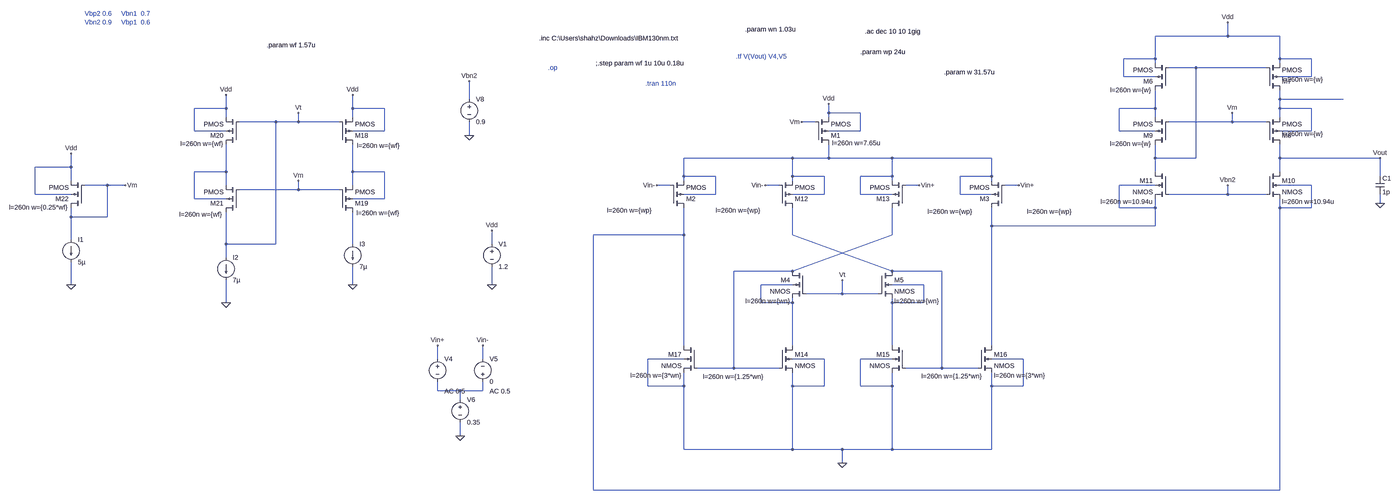
[diagram p0: schematic Recyclic_Folded_Cascode_Schm.asc, whole sheet]
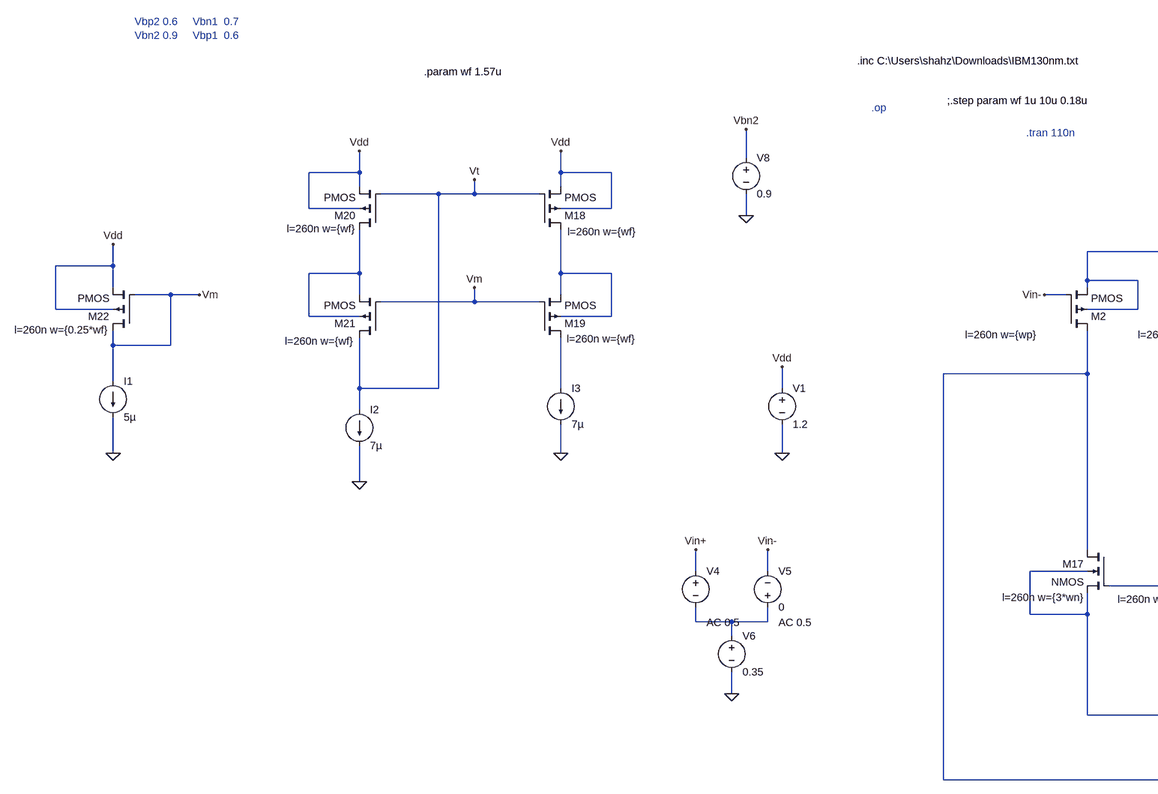
[diagram p1: schematic Recyclic_Folded_Cascode_Schm.asc, part, row 1 of 1, column 1 of 2]
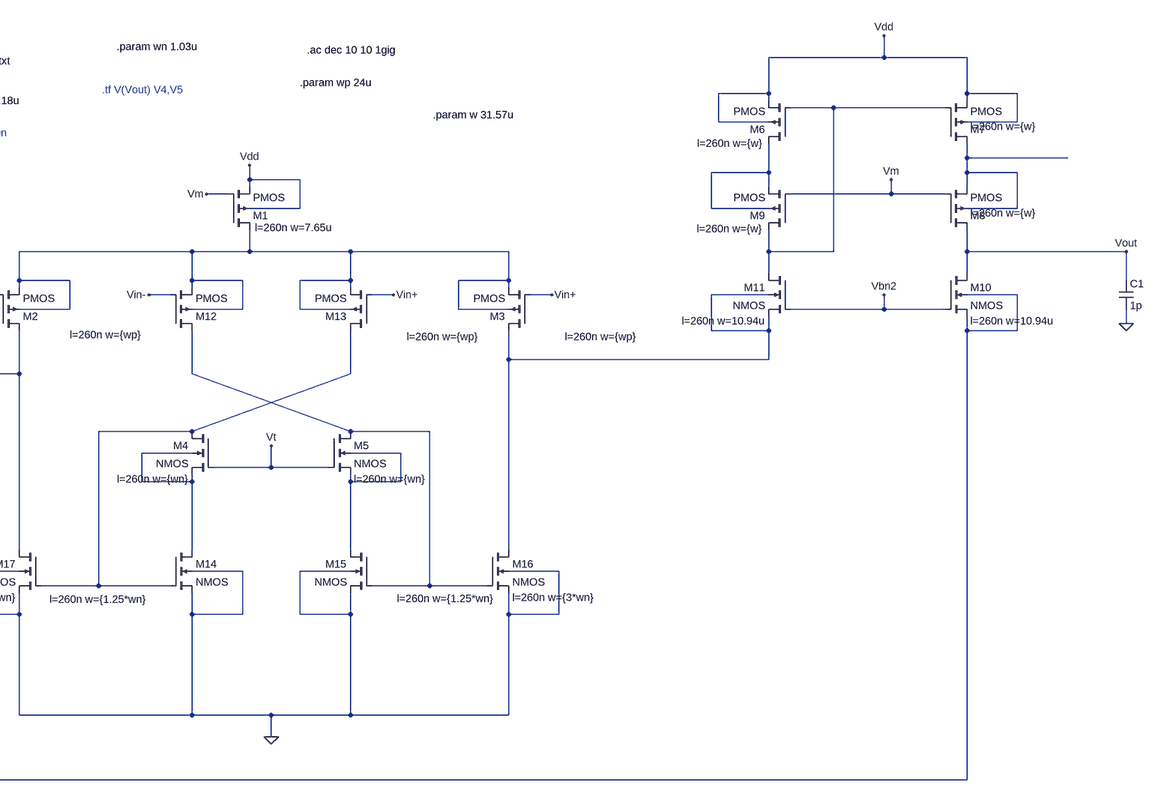
[diagram p2: schematic Recyclic_Folded_Cascode_Schm.asc, part, row 1 of 1, column 2 of 2]
Recyclic_Folded_Cascode_Schm.asc, the LTspice schematic file:
Version 4
SHEET 1 3360 2056
WIRE 1728 192 1728 144
WIRE 1728 192 1472 192
WIRE 1984 192 1728 192
WIRE 1472 272 1472 192
WIRE 1472 272 1360 272
WIRE 1984 272 1984 192
WIRE 2096 272 1984 272
WIRE 1472 288 1472 272
WIRE 1984 288 1984 272
WIRE 1616 304 1520 304
WIRE 1936 304 1616 304
WIRE 1360 336 1360 272
WIRE 1472 336 1360 336
WIRE 2096 336 2096 272
WIRE 2096 336 1984 336
WIRE -1312 416 -1312 352
WIRE 1984 416 1984 384
WIRE 2208 416 1984 416
WIRE -2192 448 -2192 400
WIRE -2192 448 -2304 448
WIRE -1744 448 -1744 400
WIRE -1632 448 -1744 448
WIRE 1472 448 1472 384
WIRE 1472 448 1344 448
WIRE 1984 448 1984 416
WIRE 2096 448 1984 448
WIRE 64 464 64 432
WIRE 176 464 64 464
WIRE -2192 480 -2192 448
WIRE -1744 480 -1744 448
WIRE 64 480 64 464
WIRE 1472 480 1472 448
WIRE 1984 480 1984 448
WIRE -2016 496 -2144 496
WIRE -1936 496 -1936 464
WIRE -1936 496 -2016 496
WIRE -1792 496 -1936 496
WIRE 16 496 -32 496
WIRE 1744 496 1744 464
WIRE 1744 496 1520 496
WIRE 1936 496 1744 496
WIRE -2304 528 -2304 448
WIRE -2192 528 -2304 528
WIRE -1632 528 -1632 448
WIRE -1632 528 -1744 528
WIRE 176 528 176 464
WIRE 176 528 64 528
WIRE 1344 528 1344 448
WIRE 1472 528 1344 528
WIRE 2096 528 2096 448
WIRE 2096 528 1984 528
WIRE -1312 544 -1312 496
WIRE -64 624 -448 624
WIRE 64 624 64 576
WIRE 64 624 -64 624
WIRE 288 624 64 624
WIRE 640 624 288 624
WIRE 1472 624 1472 576
WIRE 1616 624 1616 304
WIRE 1616 624 1472 624
WIRE 1984 624 1984 576
WIRE 2400 624 1984 624
WIRE -2768 656 -2768 608
WIRE -2768 656 -2896 656
WIRE -2192 672 -2192 576
WIRE -2192 672 -2304 672
WIRE -1744 672 -1744 576
WIRE -1632 672 -1744 672
WIRE 1472 672 1472 624
WIRE 1984 672 1984 624
WIRE -448 688 -448 624
WIRE -336 688 -448 688
WIRE -64 688 -64 624
WIRE 48 688 -64 688
WIRE 288 688 288 624
WIRE 288 688 176 688
WIRE 640 688 640 624
WIRE 640 688 528 688
WIRE 2400 688 2400 624
WIRE -2768 704 -2768 656
WIRE -448 704 -448 688
WIRE -64 704 -64 688
WIRE 288 704 288 688
WIRE 640 704 640 688
WIRE -2640 720 -2720 720
WIRE -2576 720 -2640 720
WIRE -2192 720 -2192 672
WIRE -1744 720 -1744 672
WIRE -496 720 -544 720
WIRE -112 720 -160 720
WIRE 384 720 336 720
WIRE 736 720 688 720
WIRE 1472 720 1344 720
WIRE 2096 720 1984 720
WIRE -1936 736 -1936 704
WIRE -1936 736 -2144 736
WIRE -1792 736 -1936 736
WIRE -2896 752 -2896 656
WIRE -2768 752 -2896 752
WIRE -336 752 -336 688
WIRE -336 752 -448 752
WIRE 48 752 48 688
WIRE 48 752 -64 752
WIRE 176 752 176 688
WIRE 288 752 176 752
WIRE 528 752 528 688
WIRE 640 752 528 752
WIRE 1728 752 1728 720
WIRE 1728 752 1520 752
WIRE 1936 752 1728 752
WIRE -2304 768 -2304 672
WIRE -2192 768 -2304 768
WIRE -1632 768 -1632 672
WIRE -1632 768 -1744 768
WIRE 2400 784 2400 752
WIRE 1344 800 1344 720
WIRE 1472 800 1472 768
WIRE 1472 800 1344 800
WIRE 1984 800 1984 768
WIRE 2096 800 2096 720
WIRE 2096 800 1984 800
WIRE -2768 832 -2768 800
WIRE -2640 832 -2640 720
WIRE -2640 832 -2768 832
WIRE 640 864 640 800
WIRE 1472 864 1472 800
WIRE 1472 864 640 864
WIRE -448 896 -448 800
WIRE -448 896 -768 896
WIRE -64 896 -64 800
WIRE 288 896 288 800
WIRE -2768 912 -2768 832
WIRE -2192 928 -2192 816
WIRE -2016 928 -2016 496
WIRE -2016 928 -2192 928
WIRE -1744 928 -1744 816
WIRE -1232 928 -1232 880
WIRE -2192 976 -2192 928
WIRE -64 1024 288 896
WIRE -64 1024 -272 1024
WIRE 288 1024 -64 896
WIRE 464 1024 288 1024
WIRE -2768 1072 -2768 992
WIRE -1744 1072 -1744 1008
WIRE -1232 1072 -1232 1008
WIRE -64 1072 -176 1072
WIRE 400 1072 288 1072
WIRE 112 1104 112 1056
WIRE 112 1104 -16 1104
WIRE 240 1104 112 1104
WIRE -2192 1136 -2192 1056
WIRE -176 1136 -176 1072
WIRE -64 1136 -64 1120
WIRE -64 1136 -176 1136
WIRE 288 1136 288 1120
WIRE 400 1136 400 1072
WIRE 400 1136 288 1136
WIRE -448 1312 -448 896
WIRE -64 1312 -64 1136
WIRE 288 1312 288 1136
WIRE 640 1312 640 864
WIRE -1424 1360 -1424 1312
WIRE -1264 1360 -1264 1312
WIRE -448 1360 -576 1360
WIRE 48 1360 -64 1360
WIRE 288 1360 176 1360
WIRE 752 1360 640 1360
WIRE -272 1392 -272 1024
WIRE -272 1392 -400 1392
WIRE -112 1392 -272 1392
WIRE 464 1392 464 1024
WIRE 464 1392 336 1392
WIRE 592 1392 464 1392
WIRE -576 1456 -576 1360
WIRE -448 1456 -448 1408
WIRE -448 1456 -576 1456
WIRE -64 1456 -64 1408
WIRE 48 1456 48 1360
WIRE 48 1456 -64 1456
WIRE 176 1456 176 1360
WIRE 288 1456 288 1408
WIRE 288 1456 176 1456
WIRE 640 1456 640 1408
WIRE 752 1456 752 1360
WIRE 752 1456 640 1456
WIRE -1424 1472 -1424 1440
WIRE -1344 1472 -1424 1472
WIRE -1264 1472 -1264 1440
WIRE -1264 1472 -1344 1472
WIRE -1344 1504 -1344 1472
WIRE -1344 1632 -1344 1584
WIRE -448 1680 -448 1456
WIRE -64 1680 -64 1456
WIRE -64 1680 -448 1680
WIRE 112 1680 -64 1680
WIRE 288 1680 288 1456
WIRE 288 1680 112 1680
WIRE 640 1680 640 1456
WIRE 640 1680 288 1680
WIRE 112 1728 112 1680
WIRE -768 1824 -768 896
WIRE 1984 1824 1984 800
WIRE 1984 1824 -768 1824
FLAG 64 432 Vdd
FLAG 736 720 Vin+
FLAG -1232 1072 0
FLAG -1232 880 Vdd
FLAG -1344 1632 0
FLAG -1424 1312 Vin+
FLAG -1264 1312 Vin-
FLAG 1728 144 Vdd
FLAG 1728 720 Vbn2
FLAG -1312 544 0
FLAG -1312 352 Vbn2
FLAG 2400 784 0
FLAG 2400 624 Vout
FLAG 384 720 Vin+
FLAG 112 1728 0
FLAG -544 720 Vin-
FLAG -160 720 Vin-
FLAG -2768 1072 0
FLAG -2768 608 Vdd
FLAG -2576 720 Vm
FLAG -2192 400 Vdd
FLAG -1744 400 Vdd
FLAG -2192 1136 0
FLAG -1936 704 Vm
FLAG -1936 464 Vt
FLAG -1744 1072 0
FLAG 1744 464 Vm
FLAG -32 496 Vm
FLAG 112 1056 Vt
DATAFLAG 672 864 ""
DATAFLAG 144 624 ""
DATAFLAG 2176 624 ""
DATAFLAG 2192 416 ""
DATAFLAG -64 880 ""
SYMBOL pmos4 16 576 M180
WINDOW 123 60 5 Left 2
SYMATTR Value2 l=260n w=7.65u
SYMATTR InstName M1
SYMBOL pmos4 -496 800 M180
WINDOW 123 -224 -9 Left 2
SYMATTR Value2 l=260n w={wp}
SYMATTR InstName M2
SYMBOL pmos4 688 800 R180
WINDOW 123 -236 -13 Left 2
SYMATTR Value2 l=260n w={wp}
SYMATTR InstName M3
SYMBOL nmos4 -16 1024 M0
WINDOW 123 56 106 Left 2
SYMATTR Value2 l=260n w={wn}
SYMATTR InstName M4
SYMBOL nmos4 240 1024 R0
WINDOW 123 56 106 Left 2
SYMATTR Value2 l=260n w={wn}
SYMATTR InstName M5
SYMBOL voltage -1232 912 R0
WINDOW 123 0 0 Left 0
WINDOW 39 0 0 Left 0
SYMATTR InstName V1
SYMATTR Value 1.2
SYMBOL voltage -1424 1344 R0
WINDOW 123 24 130 Left 2
WINDOW 39 0 0 Left 0
WINDOW 3 24 50 Left 2
SYMATTR Value2 AC 0.5
SYMATTR Value ""
SYMATTR InstName V4
SYMBOL voltage -1264 1456 M180
WINDOW 0 24 96 Left 2
WINDOW 3 24 16 Left 2
WINDOW 123 24 -18 Left 2
WINDOW 39 0 0 Left 0
SYMATTR InstName V5
SYMATTR Value 0
SYMATTR Value2 AC 0.5
SYMBOL voltage -1344 1488 R0
WINDOW 123 0 0 Left 0
WINDOW 39 0 0 Left 0
SYMATTR InstName V6
SYMATTR Value 0.35
SYMBOL pmos4 1520 384 R180
WINDOW 123 62 1 Left 2
SYMATTR Value2 l=260n w={w}
SYMATTR InstName M6
SYMBOL pmos4 1936 384 M180
WINDOW 123 56 38 Left 2
SYMATTR Value2 l=260n w={w}
SYMATTR InstName M7
SYMBOL pmos4 1936 576 M180
WINDOW 123 56 38 Left 2
SYMATTR Value2 l=260n w={w}
SYMATTR InstName M8
SYMBOL pmos4 1520 576 R180
WINDOW 123 63 3 Left 2
SYMATTR Value2 l=260n w={w}
SYMATTR InstName M9
SYMBOL nmos4 1936 672 R0
WINDOW 123 56 106 Left 2
SYMATTR Value2 l=260n w=10.94u
SYMATTR InstName M10
SYMBOL nmos4 1520 672 M0
WINDOW 123 56 106 Left 2
SYMATTR Value2 l=260n w=10.94u
SYMATTR InstName M11
SYMBOL voltage -1312 400 R0
WINDOW 123 0 0 Left 0
WINDOW 39 0 0 Left 0
SYMATTR InstName V8
SYMATTR Value 0.9
SYMBOL cap 2384 688 R0
SYMATTR InstName C1
SYMATTR Value 1p
SYMBOL pmos4 -112 800 M180
WINDOW 123 -224 -9 Left 2
SYMATTR Value2 l=260n w={wp}
SYMATTR InstName M12
SYMBOL pmos4 336 800 R180
WINDOW 123 -236 -13 Left 2
SYMATTR Value2 l=260n w={wp}
SYMATTR InstName M13
SYMBOL nmos4 -400 1312 M0
WINDOW 123 56 106 Left 2
SYMATTR Value2 l=260n w={3*wn}
SYMATTR InstName M17
SYMBOL nmos4 -112 1312 R0
WINDOW 123 -269 110 Left 2
SYMATTR Value2 l=260n w={1.25*wn}
SYMATTR InstName M14
SYMBOL nmos4 336 1312 M0
WINDOW 123 -271 109 Left 2
SYMATTR Value2 l=260n w={1.25*wn}
SYMATTR InstName M15
SYMBOL nmos4 592 1312 R0
WINDOW 123 56 106 Left 2
SYMATTR Value2 l=260n w={3*wn}
SYMATTR InstName M16
SYMBOL pmos4 -1792 576 M180
WINDOW 123 63 -4 Left 2
SYMATTR Value2 l=260n w={wf}
SYMATTR InstName M18
SYMBOL pmos4 -1792 816 M180
WINDOW 123 61 -2 Left 2
SYMATTR Value2 l=260n w={wf}
SYMATTR InstName M19
SYMBOL pmos4 -2144 576 R180
WINDOW 123 57 3 Left 2
SYMATTR Value2 l=260n w={wf}
SYMATTR InstName M20
SYMBOL pmos4 -2144 816 R180
WINDOW 123 61 -7 Left 2
SYMATTR Value2 l=260n w={wf}
SYMATTR InstName M21
SYMBOL pmos4 -2720 800 R180
WINDOW 123 59 2 Left 2
SYMATTR Value2 l=260n w={0.25*wf}
SYMATTR InstName M22
SYMBOL current -2768 912 R0
WINDOW 123 0 0 Left 0
WINDOW 39 0 0 Left 0
SYMATTR InstName I1
SYMATTR Value 5µ
SYMBOL current -2192 976 R0
WINDOW 123 0 0 Left 0
WINDOW 39 0 0 Left 0
SYMATTR InstName I2
SYMATTR Value 7µ
SYMBOL current -1744 928 R0
WINDOW 123 0 0 Left 0
WINDOW 39 0 0 Left 0
SYMATTR InstName I3
SYMATTR Value 7µ
TEXT -960 200 Left 2 !.inc C:\\Users\\shahz\\Downloads\\IBM130nm.txt
TEXT 176 248 Left 2 !.param wp 24u
TEXT -232 168 Left 2 !.param wn 1.03u
TEXT -760 288 Left 2 !;.step param wf 1u 10u 0.18u
TEXT -928 304 Left 2 ;.op
TEXT 192 176 Left 2 !.ac dec 10 10 1gig
TEXT -264 264 Left 2 ;.tf V(Vout) V4,V5
TEXT 472 320 Left 2 !.param w 31.57u
TEXT -584 360 Left 2 ;.tran 110n
TEXT -2048 224 Left 2 !.param wf 1.57u
TEXT -2720 112 Left 2 ;Vbp2 0.6     Vbn1  0.7\nVbn2 0.9     Vbp1  0.6

The netlist it stands for:
* Recyclic_Folded_Cascode_Schm.asc
M1 N004 Vm Vdd Vdd PMOS l=260n w=7.65u
M2 N008 Vin- N004 N004 PMOS l=260n w={wp}
M3 N007 Vin+ N004 N004 PMOS l=260n w={wp}
M4 N010 Vt N012 N012 NMOS l=260n w={wn}
M5 N009 Vt N013 N013 NMOS l=260n w={wn}
V1 Vdd 0 1.2
V4 Vin+ N014 AC 0.5
V5 N014 Vin- 0 AC 0.5
V6 N014 0 0.35
M6 N003 N001 Vdd Vdd PMOS l=260n w={w}
M7 N002 N001 Vdd Vdd PMOS l=260n w={w}
M8 Vout Vm N002 N002 PMOS l=260n w={w}
M9 N001 Vm N003 N003 PMOS l=260n w={w}
M10 Vout Vbn2 N008 N008 NMOS l=260n w=10.94u
M11 N001 Vbn2 N007 N007 NMOS l=260n w=10.94u
V8 Vbn2 0 0.9
C1 Vout 0 1p
M12 N009 Vin- N004 N004 PMOS l=260n w={wp}
M13 N010 Vin+ N004 N004 PMOS l=260n w={wp}
M17 N008 N010 0 0 NMOS l=260n w={3*wn}
M14 N012 N010 0 0 NMOS l=260n w={1.25*wn}
M15 N013 N009 0 0 NMOS l=260n w={1.25*wn}
M16 N007 N009 0 0 NMOS l=260n w={3*wn}
M18 N006 Vt Vdd Vdd PMOS l=260n w={wf}
M19 N011 Vm N006 N006 PMOS l=260n w={wf}
M20 N005 Vt Vdd Vdd PMOS l=260n w={wf}
M21 Vt Vm N005 N005 PMOS l=260n w={wf}
M22 Vm Vm Vdd Vdd PMOS l=260n w={0.25*wf}
I1 Vm 0 5µ
I2 Vt 0 7µ
I3 N011 0 7µ
.model NMOS NMOS
.model PMOS PMOS
.lib standard.mos
.inc C:\Users\shahz\Downloads\IBM130nm.txt
.param wp 24u
.param wn 1.03u
;.step param wf 1u 10u 0.18u
* .op
.ac dec 10 10 1gig
* .tf V(Vout) V4,V5
.param w 31.57u
* .tran 110n
.param wf 1.57u
* Vbp2 0.6     Vbn1  0.7
* Vbn2 0.9     Vbp1  0.6
.backanno
.end